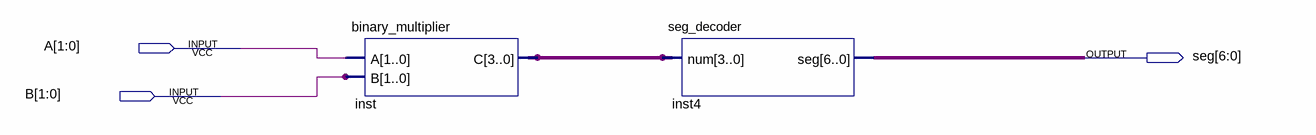
[diagram p0: schematic sheet]
// Quartus schematic proj1.bdf as structural Verilog: 2 symbols, 3 pins
module proj1 (
  input  [1:0] A,
  input  [1:0] B,
  output [6:0] seg
);

  wire [3:0] inst_c;

  binary_multiplier inst (.A(A), .B(B), .C(inst_c));
  seg_decoder inst4 (.num(inst_c), .seg(seg));
endmodule
